# EAGLE design main (EAGLE 6.3)
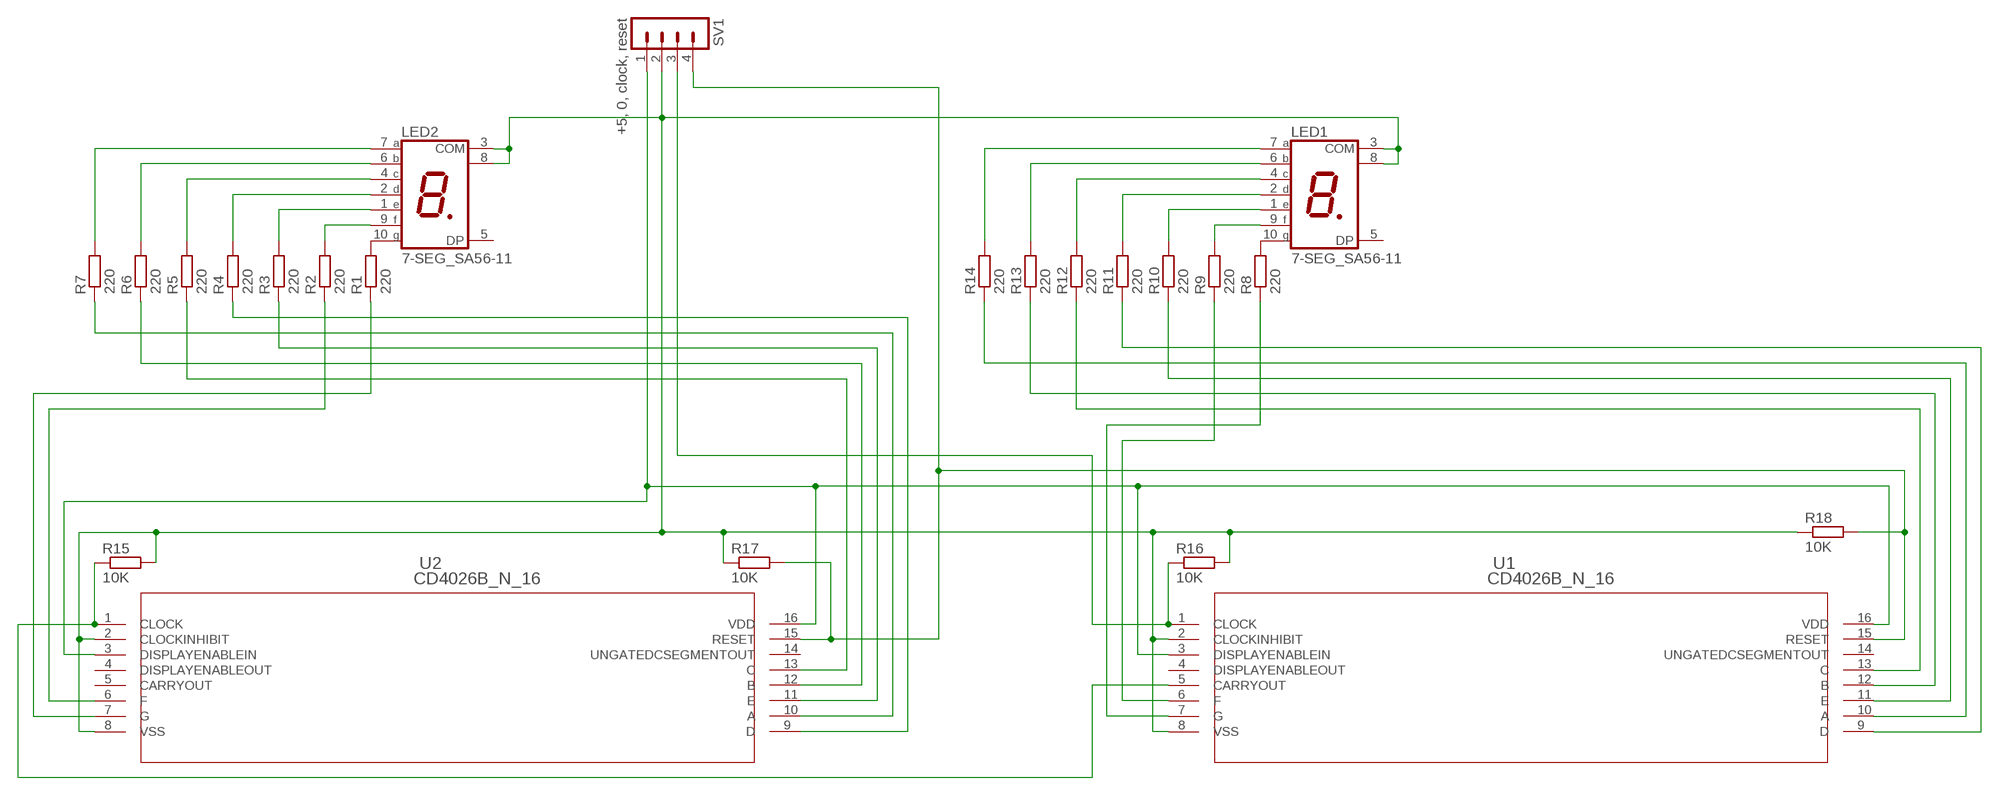
[diagram p0: schematic, sheet 1]

## Parts
LED1  7-SEG_SA56-11  [SA56-11]
LED2  7-SEG_SA56-11  [SA56-11]
R1  220  R-EU_R0805  [R0805]
R2  220  R-EU_R0805  [R0805]
R3  220  R-EU_R0805  [R0805]
R4  220  R-EU_R0805  [R0805]
R5  220  R-EU_R0805  [R0805]
R6  220  R-EU_R0805  [R0805]
R7  220  R-EU_R0805  [R0805]
R8  220  R-EU_R0805  [R0805]
R9  220  R-EU_R0805  [R0805]
R10  220  R-EU_R0805  [R0805]
R11  220  R-EU_R0805  [R0805]
R12  220  R-EU_R0805  [R0805]
R13  220  R-EU_R0805  [R0805]
R14  220  R-EU_R0805  [R0805]
R15  10K  R-EU_R0805  [R0805]
R16  10K  R-EU_R0805  [R0805]
R17  10K  R-EU_R0805  [R0805]
R18  10K  R-EU_R0805  [R0805]
SV1  +5, 0, clock, reset  MA04-1  [MA04-1]
U1  CD4026B_N_16  [N16]
U2  CD4026B_N_16  [N16]

## Nets
N$1: LED2.10(G) R1.2
N$2: LED2.9(F) R2.2
N$3: LED2.1(E) R3.2
N$4: LED2.2(D) R4.2
N$5: LED2.4(C) R5.2
N$6: LED2.6(B) R6.2
N$7: LED2.7(A) R7.2
N$8: SV1.1 U1.3(DISPLAYENABLEIN) U1.16(VDD) U2.3(DISPLAYENABLEIN) U2.16(VDD)
N$9: LED1.3(COM) LED1.8(COM) LED2.3(COM) LED2.8(COM) R15.2 R16.2 R17.1 R18.1 SV1.2 U1.2(CLOCKINHIBIT) U1.8(VSS) U2.2(CLOCKINHIBIT) U2.8(VSS)
N$10: LED1.10(G) R8.2
N$11: LED1.9(F) R9.2
N$12: LED1.1(E) R10.2
N$13: LED1.2(D) R11.2
N$14: LED1.4(C) R12.2
N$15: LED1.6(B) R13.2
N$16: LED1.7(A) R14.2
N$17: R16.1 SV1.3 U1.1(CLOCK)
N$18: R7.1 U2.10(A)
N$19: R6.1 U2.12(B)
N$21: R5.1 U2.13(C)
N$22: R4.1 U2.9(D)
N$23: R3.1 U2.11(E)
N$24: R2.1 U2.6(F)
N$25: R1.1 U2.7(G)
N$26: R17.2 R18.2 SV1.4 U1.15(RESET) U2.15(RESET)
N$27: R15.1 U1.5(CARRYOUT) U2.1(CLOCK)
N$28: R9.1 U1.6(F)
N$29: R8.1 U1.7(G)
N$30: R12.1 U1.13(C)
N$31: R13.1 U1.12(B)
N$32: R10.1 U1.11(E)
N$33: R14.1 U1.10(A)
N$34: R11.1 U1.9(D)
Unconnected: LED1.5(DP) LED2.5(DP) U1.4(DISPLAYENABLEOUT) U1.14(UNGATEDCSEGMENTOUT) U2.4(DISPLAYENABLEOUT) U2.5(CARRYOUT) U2.14(UNGATEDCSEGMENTOUT)

## Library data of the parts
LED1 LED2 = display-kingbright:7-SEG_: Kingbright 14.2mm (0.56 INCH) SINGLE DIGIT NUMERIC DUISPLAY Source: SA56-11EWA(Ver1189471036.pdf; OC_FARNELL: unknown; OC_NEWARK: unknown
R1-R18 = resistor:R-EU_: RESISTOR, European symbol
SV1 = con-lstb:MA04-1: PIN HEADER; OC_FARNELL: unknown; OC_NEWARK: unknown
U1 U2 = CD4026:CD4026B_N_16; DATASHEETURL: http://www.ti.com/lit/gpn/CD4026B; DESCRIPTION: CMOS Decade Counter/Divider with Decoded 7-Segment Display Outputs and Display Enable; FAMILY_NAME: DECADE COUNTER; GENERIC_PART_NUMBER: CD4026B; INDUSTRY_STD_PKG_TYPE: PDIP; MANUFACTURER: Texas Instruments; PACKAGE_DESIGNATOR: N; PIN_COUNT: 16

## Board
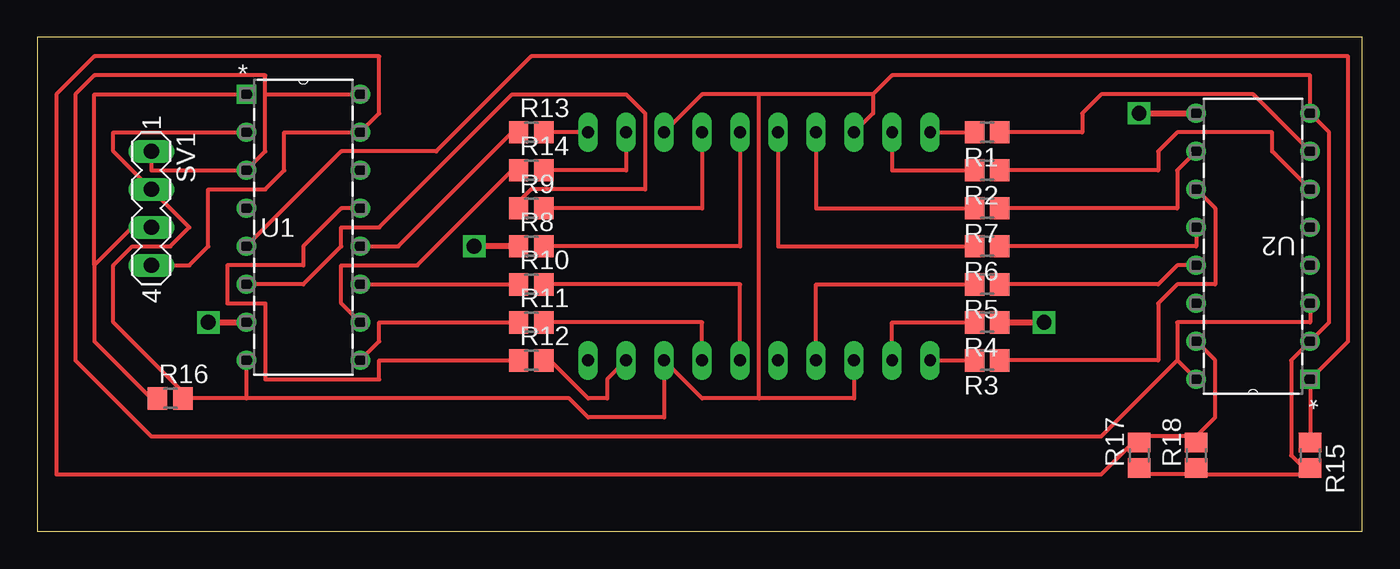
[diagram p1: board, top side]
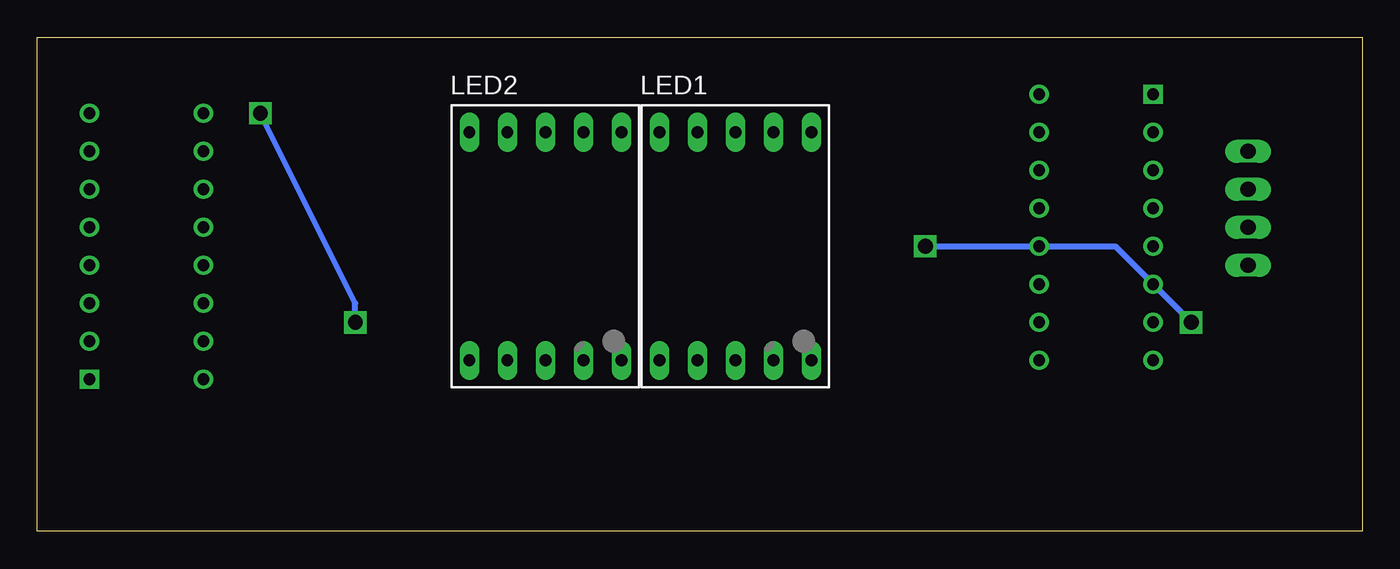
[diagram p2: board, bottom side, seen from below]

Size 88.57 x 33.01 mm. Coordinates in mm from the lower left corner, seen from the top.
Outline: 0,0 88.57,0 88.57,33.01 0,33.01 0,0
Copper layers (1*16): Top 0.035mm / dielectric 1.5mm / Bottom 0.035mm
Design rules "default": minimum track width 10mil, minimum drill 24mil, track to track 8mil, track to pad 8mil, pad to pad 8mil, via to via 8mil, smd to smd 8mil, copper to edge 40mil, drill to drill 8mil, minimum pad ring 10mil, minimum via ring 8mil, stop-mask expansion 4mil, vias tented up to drill 0mil, thermal gap 10mil

### Footprints (pad centres in the part's own frame; a part is rotated, then mirrored left to right if it is on the bottom)
SA56-11 = drill 0.8 long: 1 -5.08,-7.62; 2 -2.54,-7.62; 3 0,-7.62; 4 2.54,-7.62; 5 5.08,-7.62; 6 5.08,7.62; 7 2.54,7.62; 8 0,7.62; 9 -2.54,7.62; 10 -5.08,7.62
R0805 = smd 1.3 x 1.5: 1 -0.85,0; 2 0.85,0
MA04-1 = drill 1.016 long: 1 -3.81,0; 2 -1.27,0; 3 1.27,0; 4 3.81,0
N16 = drill 0.787 square: 1 -7.62,17.78 | drill 0.787: 2 -7.62,15.24; 3 -7.62,12.7; 4 -7.62,10.16; 5 -7.62,7.62; 6 -7.62,5.08; 7 -7.62,2.54; 8 -7.62,0; 9 0,0; 10 0,2.54; 11 0,5.08; 12 0,7.62; 13 0,10.16; 14 0,12.7; 15 0,15.24; 16 0,17.78

### Placement (x,y rotation side)
LED1  41.91,19.05 0 bottom
LED2  54.61,19.05 0 bottom
R1  63.5,26.67 180 top
R2  63.5,24.13 180 top
R3  63.5,11.43 180 top
R4  63.5,13.97 180 top
R5  63.5,16.51 180 top
R6  63.5,19.05 180 top
R7  63.5,21.59 180 top
R8  33.02,19.05 0 top
R9  33.02,21.59 0 top
R10  33.02,16.51 0 top
R11  33.02,13.97 0 top
R12  33.02,11.43 0 top
R13  33.02,26.67 0 top
R14  33.02,24.13 0 top
R15  85.09,5.08 270 top
R16  8.89,8.89 0 top
R17  73.66,5.08 90 top
R18  77.47,5.08 90 top
SV1  7.62,21.59 270 top
U1  21.59,11.43 0 top
U2  77.47,27.94 180 top

### Tracks (layer width: path | path; a pad name or v marks a point on that pad's centre or on a via)
N$1
  Top 0.254: LED2.10 R1.2
N$2
  Top 0.254: R2.2 57.15,24.13 LED2.9
N$3
  Top 0.254: LED2.1 R3.2
N$4
  Top 0.254: R4.2 57.15,13.97 LED2.2
N$5
  Top 0.254: R5.2 52.07,16.51 LED2.4
N$6
  Top 0.254: R6.2 49.53,19.05 LED2.6
N$7
  Top 0.254: R7.2 52.07,21.59 LED2.7
N$8
  Top 0.254: 76.2,11.43 U2.16 | 76.2,11.43 76.2,13.97 85.09,13.97 U2.3 | SV1.1 7.62,24.13 U1.3 15.24,25.4 15.24,29.21 | 15.24,29.21 U1.16 | 76.2,11.43 71.12,6.35 7.62,6.35 2.54,11.43 2.54,29.21 3.81,30.48 15.24,30.48 15.24,29.21
N$9
  Top 0.254: LED2.8 55.88,27.94 55.88,29.21 | 55.88,29.21 57.15,30.48 85.09,30.48 U2.8 86.36,26.67 86.36,13.97 U2.2 83.82,11.43 83.82,5.08 85.09,3.81 | LED1.8 44.45,29.21 48.26,29.21 | 55.88,29.21 48.26,29.21 | U1.2 5.08,26.67 5.08,25.4 SV1.2 10.16,20.32 8.89,19.05 6.35,19.05 5.08,17.78 5.08,13.97 10.16,8.89 | 13.97,8.89 10.16,8.89 | U1.8 13.97,8.89 | 48.26,8.89 54.61,8.89 LED2.3 | 48.26,8.89 44.45,8.89 LED1.3 41.91,7.62 36.83,7.62 35.56,8.89 13.97,8.89 | 10.16,8.89 R16.2 | 48.26,8.89 48.26,29.21 | 77.47,3.81 73.66,3.81 R17.1 | 77.47,3.81 85.09,3.81 | 77.47,3.81 R18.1 | 85.09,3.81 R15.2
N$10
  Top 0.254: R8.2 46.99,19.05 LED1.10
N$11
  Top 0.254: R9.2 44.45,21.59 LED1.9
N$12
  Top 0.254: R10.2 46.99,16.51 LED1.1
N$13
  Top 0.254: R11.2 44.45,13.97 LED1.2
N$14
  Top 0.254: LED1.4 38.1,10.16 38.1,8.89 36.83,8.89 34.29,11.43 R12.2
N$15
  Top 0.254: LED1.6 R13.2
N$16
  Top 0.254: R14.2 39.37,24.13 LED1.7
N$17
  Top 0.254: 3.81,17.78 3.81,12.7 7.62,8.89 R16.1 | 3.81,17.78 6.35,20.32 SV1.3 | U1.1 3.81,29.21 3.81,17.78
N$18
  Top 0.254: R7.1 76.2,21.59 76.2,24.13 U2.10
N$19
  Top 0.254: R6.1 77.47,19.05 U2.12
N$21
  Top 0.254: R5.1 74.93,16.51 76.2,17.78 U2.13
N$22  (via drill 1)
  Top 0.406: R4.1 v67.31,13.97 | v73.66,27.94 U2.9
  Bottom 0.406: v67.31,13.97 67.31,15.24 v73.66,27.94
N$23
  Top 0.254: R3.1 74.93,11.43 74.93,15.24 76.2,16.51 78.74,16.51 78.74,21.59 U2.11
N$24
  Top 0.254: R2.1 74.93,24.13 74.93,25.4 76.2,26.67 82.55,26.67 82.55,25.4 U2.6
N$25
  Top 0.254: R1.1 69.85,26.67 69.85,27.94 71.12,29.21 81.28,29.21 U2.7
N$26
  Top 0.254: SV1.4 10.16,17.78 11.43,19.05 11.43,22.86 15.24,22.86 16.51,24.13 16.51,26.67 U1.15 22.86,27.94 22.86,31.75 3.81,31.75 1.27,29.21 1.27,3.81 71.12,3.81 73.66,6.35 | 77.47,6.35 73.66,6.35 | U2.15 78.74,11.43 78.74,7.62 77.47,6.35 | 77.47,6.35 R18.2 | 73.66,6.35 R17.2
N$27
  Top 0.254: U1.5 20.32,25.4 26.67,25.4 33.02,31.75 87.63,31.75 87.63,12.7 U2.1 R15.1
N$28
  Top 0.254: R9.1 31.75,21.59 33.02,22.86 40.64,22.86 40.64,27.94 39.37,29.21 31.75,29.21 22.86,20.32 20.32,20.32 20.32,19.05 17.78,16.51 U1.6
N$29  (via drill 1)
  Top 0.406: R8.1 v29.21,19.05 | v11.43,13.97 U1.7
  Bottom 0.406: v29.21,19.05 16.51,19.05 v11.43,13.97
N$30
  Top 0.254: R12.1 22.86,11.43 22.86,10.16 15.24,10.16 15.24,15.24 12.7,15.24 12.7,17.78 17.78,17.78 17.78,19.05 20.32,21.59 U1.13
N$31
  Top 0.254: U1.12 24.13,19.05 31.75,26.67 R13.1
N$32
  Top 0.254: U1.11 R10.1
N$33
  Top 0.254: U1.10 20.32,15.24 20.32,17.78 25.4,17.78 31.75,24.13 R14.1
N$34
  Top 0.254: R11.1 22.86,13.97 22.86,12.7 U1.9